# Altium schematic sheet sparkfun_nrf52.SchDoc
size A4
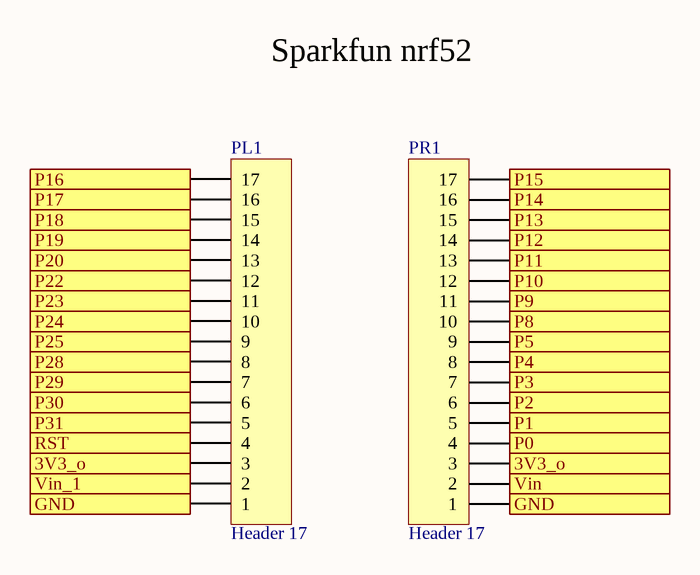
[diagram p0: sparkfun_nrf52.SchDoc]

## Parts
PL1  Header 17  [HDR1X17]
PR1  Header 17  [HDR1X17]

## Ports
3V3_o, GND, P0, P1, P2, P3, P4, P5, P8, P9, P10, P11, P12, P13, P14, P15, P16, P17, P18, P19, P20, P22, P23, P24, P25, P28, P29, P30, P31, RST, Vin, Vin_1

## Nets
3V3_o: PL1.3 PR1.3 ; port 3V3_o
GND: PL1.1 PR1.1 ; port GND
P0: PR1.4 ; port P0
P1: PR1.5 ; port P1
P2: PR1.6 ; port P2
P3: PR1.7 ; port P3
P4: PR1.8 ; port P4
P5: PR1.9 ; port P5
P8: PR1.10 ; port P8
P9: PR1.11 ; port P9
P10: PR1.12 ; port P10
P11: PR1.13 ; port P11
P12: PR1.14 ; port P12
P13: PR1.15 ; port P13
P14: PR1.16 ; port P14
P15: PR1.17 ; port P15
P16: PL1.17 ; port P16
P17: PL1.16 ; port P17
P18: PL1.15 ; port P18
P19: PL1.14 ; port P19
P20: PL1.13 ; port P20
P22: PL1.12 ; port P22
P23: PL1.11 ; port P23
P24: PL1.10 ; port P24
P25: PL1.9 ; port P25
P28: PL1.8 ; port P28
P29: PL1.7 ; port P29
P30: PL1.6 ; port P30
P31: PL1.5 ; port P31
RST: PL1.4 ; port RST
Vin: PR1.2 ; port Vin
Vin_1: PL1.2 ; port Vin_1

## Notes on the sheet
- Sparkfun nrf52

## Library data of the parts
PL1 PR1 = Header 17: Header, 17-Pin; LatestRevisionDate: 17-Jul-2002; LatestRevisionNote: Re-released for DXP Platform.; Publisher: Altium Limited